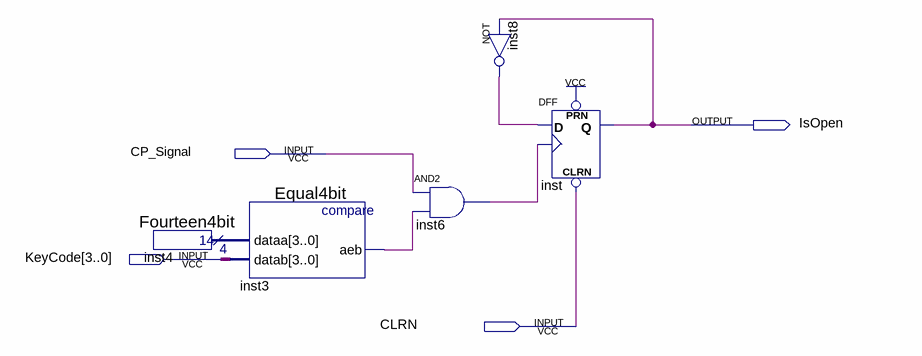
[diagram p0: schematic sheet]
// Quartus schematic OpenDoor.bdf as structural Verilog: 5 symbols, 4 pins
module OpenDoor (
  input  CP_Signal,
  input  [3:0] KeyCode,
  input  CLRN,
  output IsOpen
);

  wire inst3_aeb, inst6_out, inst8_out;
  wire [3:0] inst4_result;

  Fourteen4bit inst4 (.result(inst4_result));
  Equal4bit inst3 (.dataa(inst4_result), .datab(KeyCode), .aeb(inst3_aeb));
  and inst6 (inst6_out, CP_Signal, inst3_aeb);
  not inst8 (inst8_out, IsOpen);
  DFF inst (.CLRN(CLRN), .CLK(inst6_out), .D(inst8_out), .PRN(1'b1), .Q(IsOpen));
endmodule
